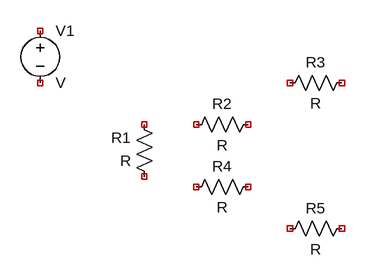
[diagram p0: schematic 檢流電路.asc]
檢流電路.asc, the LTspice schematic file:
Version 4
SHEET 1 880 680
SYMBOL voltage 0 -80 R0
SYMATTR InstName V1
SYMBOL res 176 176 R180
WINDOW 0 36 76 Left 2
WINDOW 3 36 40 Left 2
SYMATTR InstName R1
SYMBOL res 224 96 R270
WINDOW 0 32 56 VTop 2
WINDOW 3 0 56 VBottom 2
SYMATTR InstName R2
SYMBOL res 368 32 R270
WINDOW 0 32 56 VTop 2
WINDOW 3 0 56 VBottom 2
SYMATTR InstName R3
SYMBOL res 224 192 R270
WINDOW 0 32 56 VTop 2
WINDOW 3 0 56 VBottom 2
SYMATTR InstName R4
SYMBOL res 368 256 R270
WINDOW 0 32 56 VTop 2
WINDOW 3 0 56 VBottom 2
SYMATTR InstName R5

The netlist it stands for:
* 檢流電路.asc
V1 NC_01 NC_02 V
R1 NC_03 NC_04 R
R2 NC_05 NC_06 R
R3 NC_07 NC_08 R
R4 NC_09 NC_10 R
R5 NC_11 NC_12 R
.backanno
.end